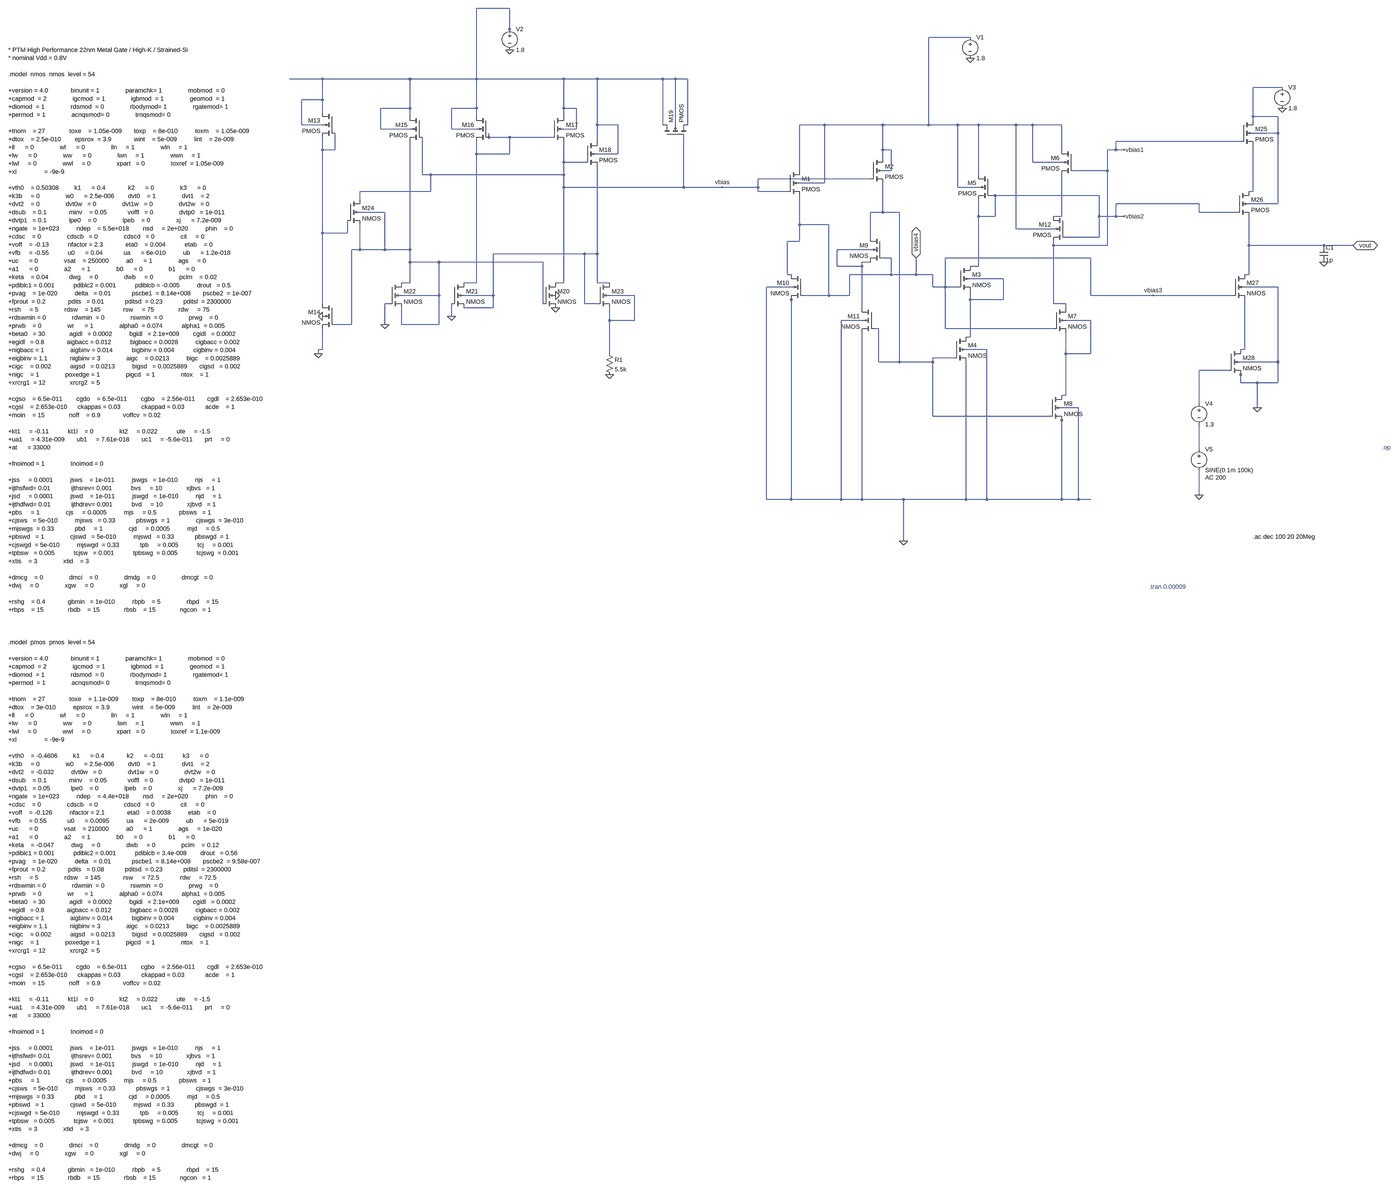
[diagram p0: schematic 22NM_CIRCUIT.asc, whole sheet]
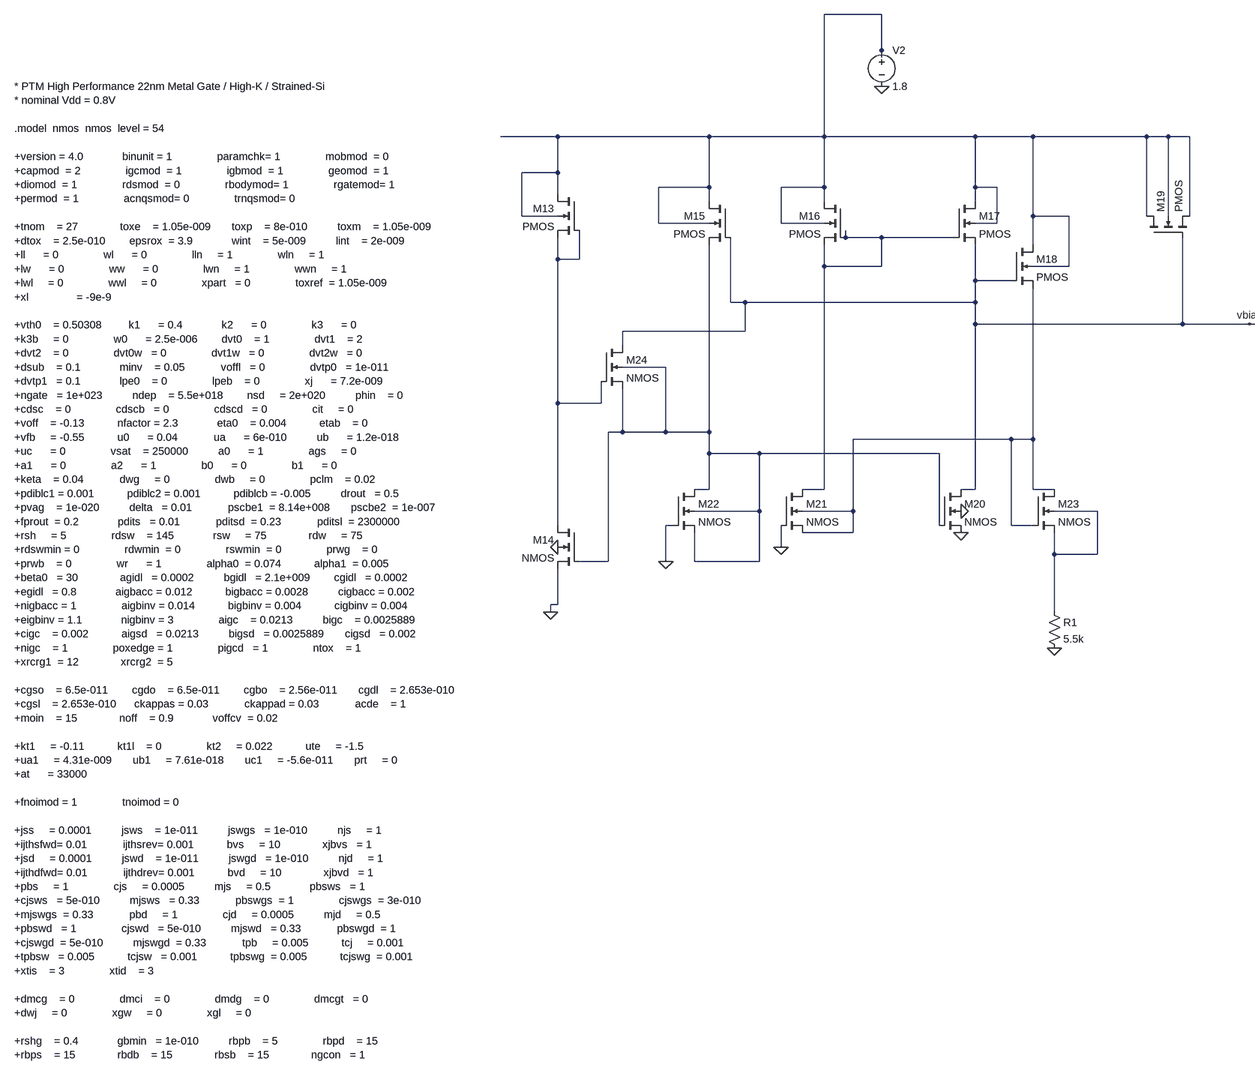
[diagram p1: schematic 22NM_CIRCUIT.asc, part, row 1 of 2, column 1 of 2]
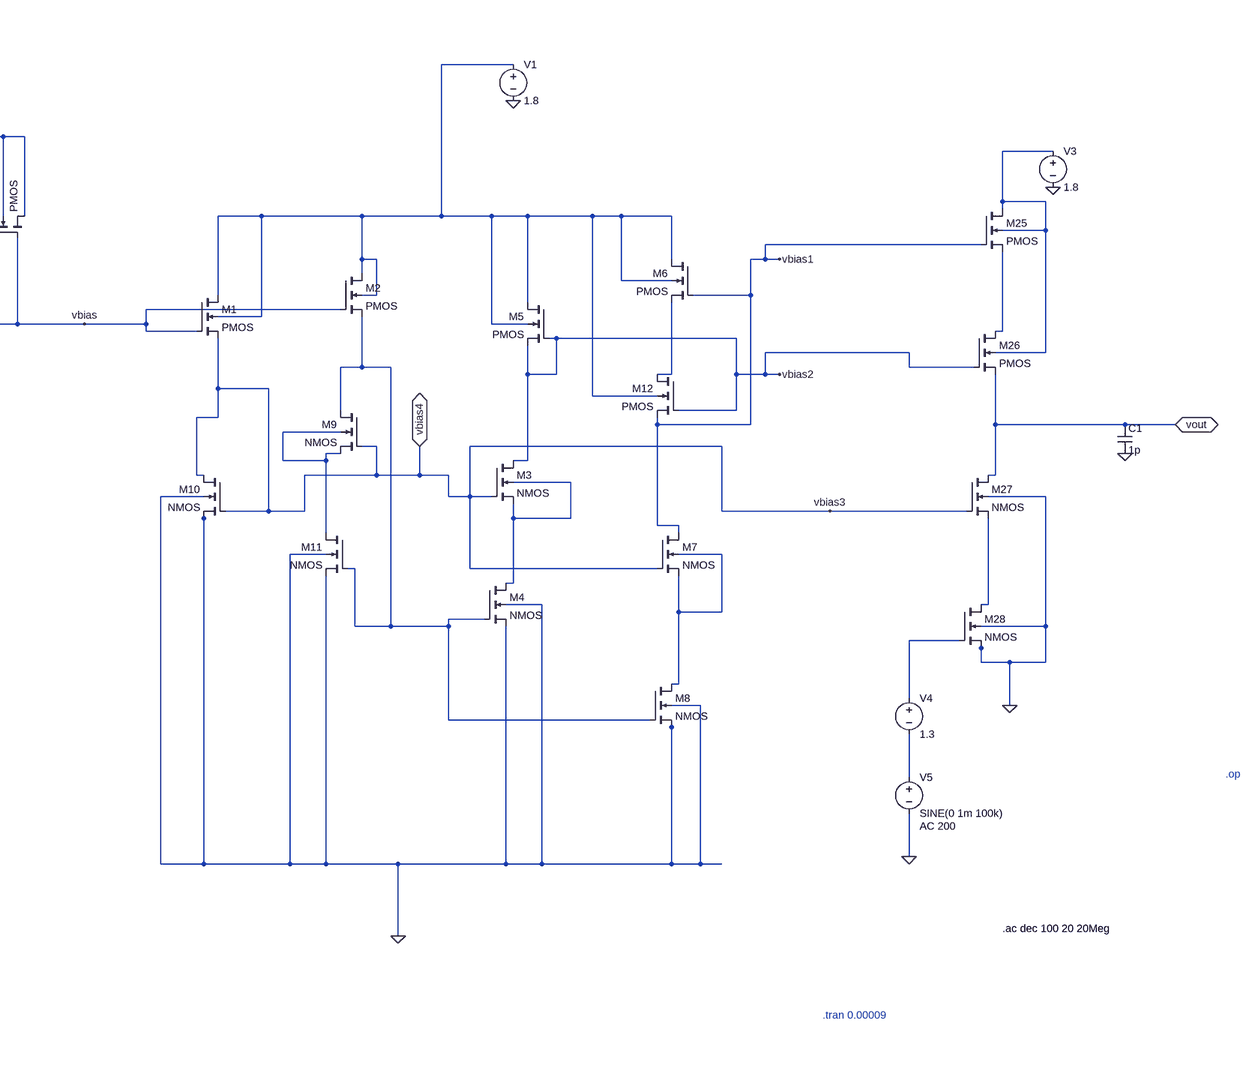
[diagram p2: schematic 22NM_CIRCUIT.asc, part, row 1 of 2, column 2 of 2]
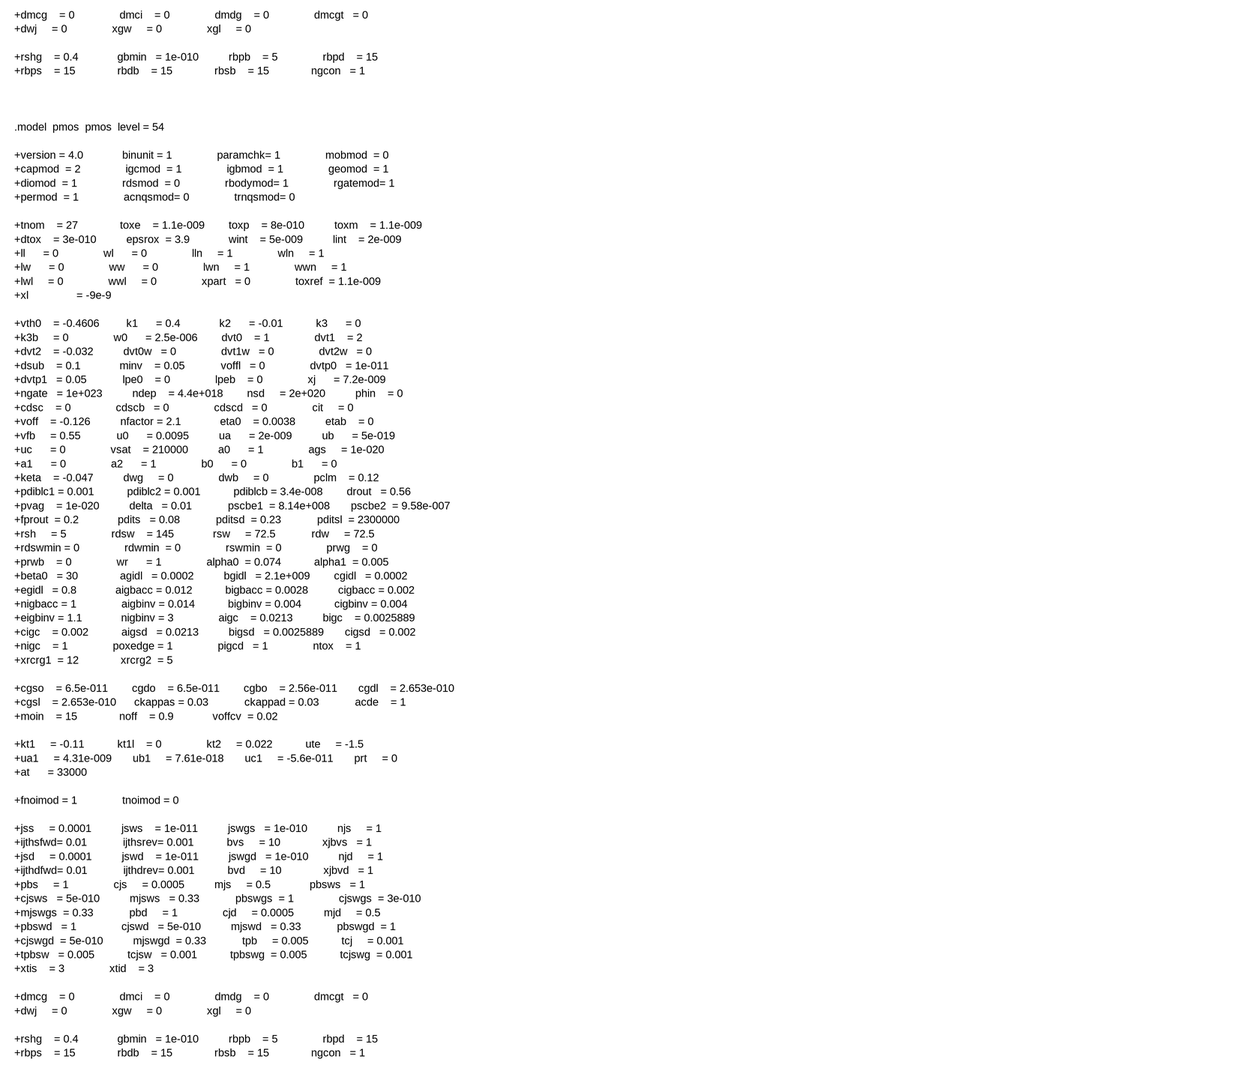
[diagram p3: schematic 22NM_CIRCUIT.asc, part, row 2 of 2, column 1 of 2]
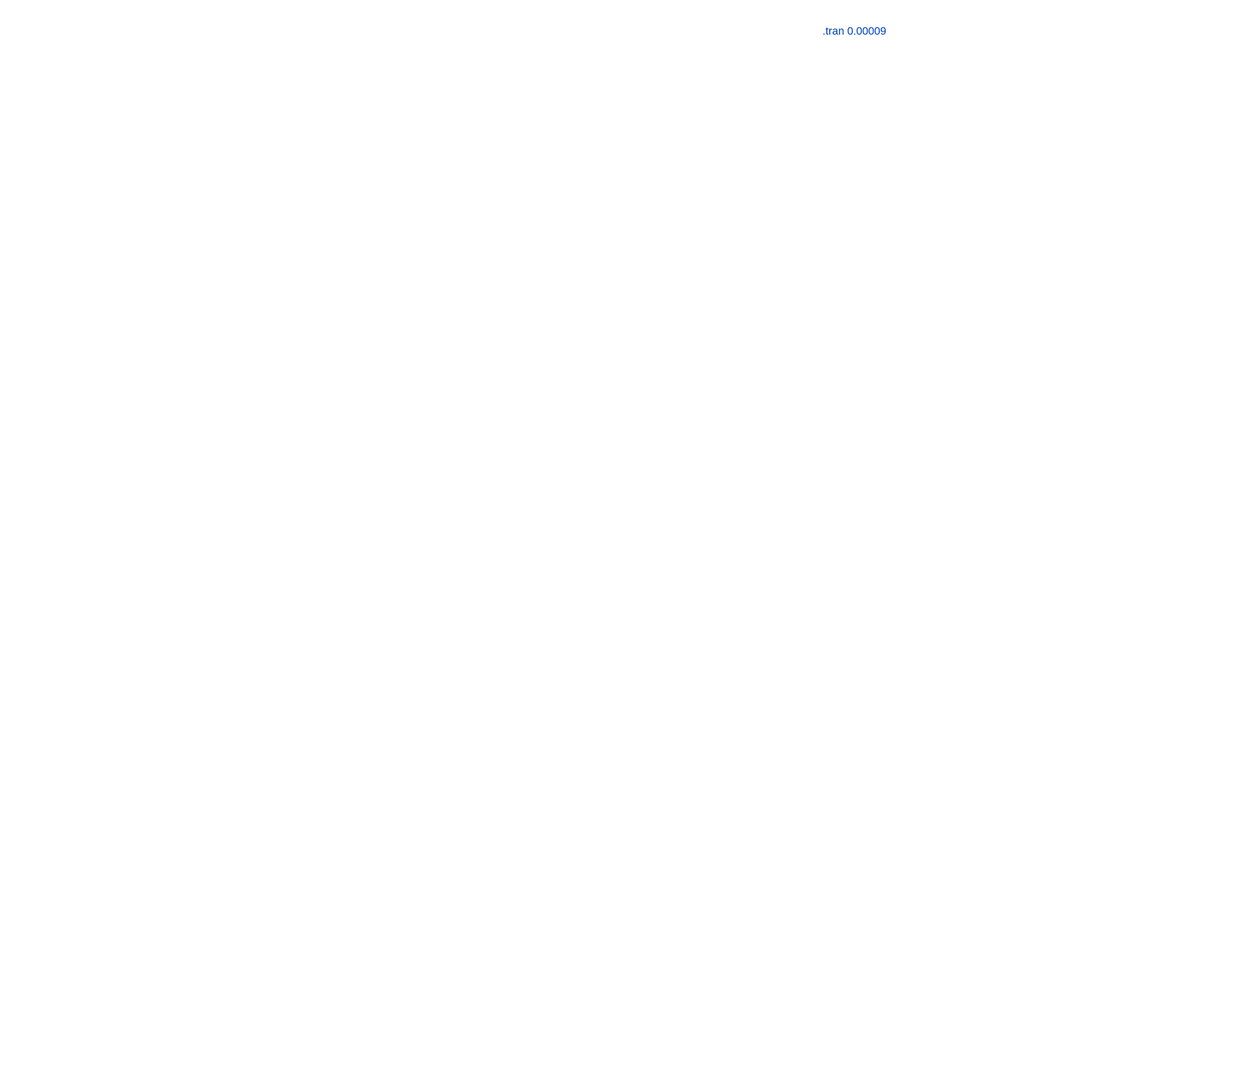
[diagram p4: schematic 22NM_CIRCUIT.asc, part, row 2 of 2, column 2 of 2]
22NM_CIRCUIT.asc, the LTspice schematic file:
Version 4
SHEET 1 4888 3128
WIRE 1008 -912 880 -912
WIRE 1008 -832 1008 -912
WIRE 1008 -816 1008 -832
WIRE 3264 -800 3104 -800
WIRE 288 -640 160 -640
WIRE 624 -640 288 -640
WIRE 880 -640 880 -912
WIRE 880 -640 624 -640
WIRE 1216 -640 880 -640
WIRE 1344 -640 1216 -640
WIRE 1632 -640 1344 -640
WIRE 1680 -640 1632 -640
WIRE 1728 -640 1680 -640
WIRE 4464 -608 4352 -608
WIRE 288 -560 288 -640
WIRE 288 -560 208 -560
WIRE 624 -528 624 -640
WIRE 624 -528 512 -528
WIRE 880 -528 880 -640
WIRE 880 -528 784 -528
WIRE 1216 -528 1216 -640
WIRE 1264 -528 1216 -528
WIRE 288 -512 288 -560
WIRE 624 -496 624 -528
WIRE 880 -496 880 -528
WIRE 1216 -496 1216 -528
WIRE 4352 -496 4352 -608
WIRE 4448 -496 4352 -496
WIRE 4352 -480 4352 -496
WIRE 208 -464 208 -560
WIRE 288 -464 208 -464
WIRE 1344 -464 1344 -640
WIRE 1424 -464 1344 -464
WIRE 1632 -464 1632 -640
WIRE 1680 -464 1680 -640
WIRE 1728 -464 1728 -640
WIRE 2704 -464 2608 -464
WIRE 2928 -464 2704 -464
WIRE 3104 -464 3104 -800
WIRE 3104 -464 2928 -464
WIRE 3216 -464 3104 -464
WIRE 3296 -464 3216 -464
WIRE 3440 -464 3296 -464
WIRE 3504 -464 3440 -464
WIRE 3616 -464 3504 -464
WIRE 512 -448 512 -528
WIRE 624 -448 512 -448
WIRE 784 -448 784 -528
WIRE 880 -448 784 -448
WIRE 1264 -448 1264 -528
WIRE 1264 -448 1216 -448
WIRE 4448 -432 4448 -496
WIRE 4448 -432 4352 -432
WIRE 928 -416 928 -432
WIRE 1008 -416 928 -416
WIRE 1168 -416 1008 -416
WIRE 1344 -400 1344 -464
WIRE 4304 -400 3824 -400
WIRE 288 -368 288 -416
WIRE 336 -368 336 -432
WIRE 336 -368 288 -368
WIRE 2928 -368 2928 -464
WIRE 2960 -368 2928 -368
WIRE 3616 -368 3616 -464
WIRE 3824 -368 3824 -400
WIRE 3824 -368 3792 -368
WIRE 3856 -368 3824 -368
WIRE 880 -352 880 -400
WIRE 1008 -352 1008 -416
WIRE 1008 -352 880 -352
WIRE 1424 -352 1424 -464
WIRE 1424 -352 1344 -352
WIRE 2928 -336 2928 -368
WIRE 1216 -320 1216 -400
WIRE 1296 -320 1216 -320
WIRE 3504 -320 3504 -464
WIRE 3616 -320 3504 -320
WIRE 2608 -288 2608 -464
WIRE 2960 -288 2960 -368
WIRE 2960 -288 2928 -288
WIRE 3792 -288 3792 -368
WIRE 3792 -288 3664 -288
WIRE 672 -272 672 -416
WIRE 704 -272 672 -272
WIRE 1216 -272 1216 -320
WIRE 1216 -272 704 -272
WIRE 3296 -272 3296 -464
WIRE 2880 -256 2448 -256
WIRE 2704 -240 2704 -464
WIRE 2704 -240 2608 -240
WIRE 1216 -224 1216 -272
WIRE 1712 -224 1712 -416
WIRE 1712 -224 1216 -224
WIRE 2064 -224 1712 -224
WIRE 2448 -224 2448 -256
WIRE 2448 -224 2064 -224
WIRE 3216 -224 3216 -464
WIRE 3296 -224 3216 -224
WIRE 704 -208 704 -272
WIRE 704 -208 432 -208
WIRE 2448 -208 2448 -224
WIRE 2560 -208 2448 -208
WIRE 4352 -208 4352 -384
WIRE 4352 -208 4336 -208
WIRE 3360 -192 3344 -192
WIRE 3760 -192 3360 -192
WIRE 432 -176 432 -208
WIRE 4144 -160 3824 -160
WIRE 4448 -160 4448 -432
WIRE 4448 -160 4336 -160
WIRE 528 -128 432 -128
WIRE 2928 -128 2928 -240
WIRE 2928 -128 2880 -128
WIRE 2992 -128 2928 -128
WIRE 4144 -128 4144 -160
WIRE 4288 -128 4144 -128
WIRE 3296 -112 3296 -176
WIRE 3360 -112 3360 -192
WIRE 3360 -112 3296 -112
WIRE 3616 -112 3616 -272
WIRE 3616 -112 3584 -112
WIRE 3760 -112 3760 -192
WIRE 3824 -112 3824 -160
WIRE 3824 -112 3760 -112
WIRE 3856 -112 3824 -112
WIRE 2608 -80 2608 -192
WIRE 2720 -80 2608 -80
WIRE 3440 -64 3440 -464
WIRE 3584 -64 3440 -64
WIRE 288 -48 288 -368
WIRE 384 -48 384 -96
WIRE 384 -48 288 -48
WIRE 2880 -32 2880 -128
WIRE 3760 -32 3760 -112
WIRE 3760 -32 3632 -32
WIRE 2608 -16 2608 -80
WIRE 2608 -16 2560 -16
WIRE 3584 0 3584 -16
WIRE 3792 0 3792 -288
WIRE 3792 0 3584 0
WIRE 4336 0 4336 -112
WIRE 4624 0 4336 0
WIRE 4736 0 4624 0
WIRE 432 16 432 -80
WIRE 432 16 400 16
WIRE 528 16 528 -128
WIRE 528 16 432 16
WIRE 624 16 624 -400
WIRE 624 16 528 16
WIRE 2880 16 2752 16
WIRE 1296 32 944 32
WIRE 1344 32 1344 -304
WIRE 1344 32 1296 32
WIRE 2960 48 2928 48
WIRE 3728 48 3168 48
WIRE 624 64 624 16
WIRE 736 64 624 64
WIRE 1136 64 736 64
WIRE 2880 64 2848 64
WIRE 2752 80 2752 16
WIRE 2848 80 2848 64
WIRE 2848 80 2752 80
WIRE 3296 80 3296 -112
WIRE 3296 80 3264 80
WIRE 2560 112 2560 -16
WIRE 2576 112 2560 112
WIRE 2960 112 2960 48
WIRE 2960 112 2800 112
WIRE 3056 112 3056 48
WIRE 3056 112 2960 112
WIRE 3120 112 3056 112
WIRE 4336 112 4336 0
WIRE 4336 112 4320 112
WIRE 3392 128 3264 128
WIRE 624 144 624 64
WIRE 624 144 592 144
WIRE 880 144 880 -352
WIRE 880 144 832 144
WIRE 1216 144 1216 -224
WIRE 1216 144 1184 144
WIRE 1344 144 1344 32
WIRE 1392 144 1344 144
WIRE 2576 160 2480 160
WIRE 3120 160 3120 112
WIRE 3168 160 3168 48
WIRE 3168 160 3120 160
WIRE 3216 160 3168 160
WIRE 4448 160 4320 160
WIRE 736 192 736 64
WIRE 736 192 592 192
WIRE 944 192 944 32
WIRE 944 192 832 192
WIRE 1488 192 1392 192
WIRE 2720 192 2720 -80
WIRE 2720 192 2624 192
WIRE 2800 192 2800 112
WIRE 2800 192 2720 192
WIRE 3728 192 3728 48
WIRE 3968 192 3728 192
WIRE 4272 192 3968 192
WIRE 2576 208 2576 192
WIRE 3264 208 3264 176
WIRE 3392 208 3392 128
WIRE 3392 208 3264 208
WIRE 288 224 288 -48
WIRE 544 224 528 224
WIRE 1136 224 1136 64
WIRE 1296 224 1296 32
WIRE 1344 224 1296 224
WIRE 3584 224 3584 0
WIRE 3632 224 3584 224
WIRE 944 240 944 192
WIRE 944 240 832 240
WIRE 2848 240 2848 80
WIRE 3632 240 3632 224
WIRE 784 272 784 224
WIRE 1392 288 1392 240
WIRE 1488 288 1488 192
WIRE 1488 288 1392 288
WIRE 2848 288 2768 288
WIRE 3728 288 3632 288
WIRE 400 304 400 16
WIRE 400 304 336 304
WIRE 528 304 528 224
WIRE 592 304 592 240
WIRE 736 304 736 192
WIRE 736 304 592 304
WIRE 2912 320 2896 320
WIRE 3168 320 3168 160
WIRE 3584 320 3168 320
WIRE 3264 352 3264 208
WIRE 3264 352 3248 352
WIRE 288 400 288 320
WIRE 288 400 272 400
WIRE 3328 400 3248 400
WIRE 4320 400 4320 208
WIRE 4320 400 4304 400
WIRE 272 416 272 400
WIRE 1392 416 1392 288
WIRE 3632 416 3632 336
WIRE 3728 416 3728 288
WIRE 3728 416 3632 416
WIRE 3200 432 3120 432
WIRE 2912 448 2912 320
WIRE 2992 448 2992 -128
WIRE 2992 448 2912 448
WIRE 3120 448 3120 432
WIRE 3120 448 2992 448
WIRE 4448 448 4448 160
WIRE 4448 448 4304 448
WIRE 4256 480 4144 480
WIRE 4304 496 4304 480
WIRE 4304 528 4304 496
WIRE 4368 528 4304 528
WIRE 4448 528 4448 448
WIRE 4448 528 4368 528
WIRE 3632 576 3632 416
WIRE 3632 576 3616 576
WIRE 4144 608 4144 480
WIRE 3680 624 3616 624
WIRE 4368 624 4368 528
WIRE 3120 656 3120 448
WIRE 3568 656 3120 656
WIRE 3616 672 3616 656
WIRE 4144 784 4144 688
WIRE 4144 960 4144 864
WIRE 2480 976 2480 160
WIRE 2576 976 2576 208
WIRE 2576 976 2480 976
WIRE 2768 976 2768 288
WIRE 2768 976 2576 976
WIRE 2848 976 2848 336
WIRE 2848 976 2768 976
WIRE 3008 976 2848 976
WIRE 3248 976 3248 448
WIRE 3248 976 3008 976
WIRE 3328 976 3328 400
WIRE 3328 976 3248 976
WIRE 3616 976 3616 672
WIRE 3616 976 3328 976
WIRE 3680 976 3680 624
WIRE 3680 976 3616 976
WIRE 3728 976 3680 976
WIRE 3008 1136 3008 976
FLAG 3856 -112 vbias2
FLAG 3856 -368 vbias1
FLAG 4464 -528 0
FLAG 4368 624 0
FLAG 4144 960 0
FLAG 4624 64 0
FLAG 4736 0 vout
IOPIN 4736 0 BiDir
FLAG 3968 192 vbias3
FLAG 3056 48 vbias4
IOPIN 3056 48 BiDir
FLAG 3264 -720 0
FLAG 3008 1136 0
FLAG 1392 496 0
FLAG 1184 240 0
FLAG 784 272 0
FLAG 528 304 0
FLAG 272 416 0
FLAG 1184 192 0
FLAG 288 272 0
FLAG 2064 -224 vbias
FLAG 1008 -752 0
DATAFLAG 3296 -64 ""
DATAFLAG 3296 -320 ""
SYMBOL nmos4 4304 -480 R0
SYMATTR InstName M25
SYMATTR Value PMOS
SYMATTR Value2 l=0.022u w=0.497u
SYMBOL nmos4 4288 -208 R0
SYMATTR InstName M26
SYMATTR Value PMOS
SYMATTR Value2 l=0.022u w=0.497u
SYMBOL nmos4 4272 112 R0
SYMATTR InstName M27
SYMATTR Value2 l=0.022u w=0.248u
SYMBOL nmos4 4256 400 R0
SYMATTR InstName M28
SYMATTR Value2 l=0.022u w=0.248u
SYMBOL voltage 4464 -624 R0
WINDOW 123 0 0 Left 0
WINDOW 39 0 0 Left 0
SYMATTR InstName V3
SYMATTR Value 1.8
SYMBOL cap 4608 0 R0
SYMATTR InstName C1
SYMATTR Value 1p
SYMBOL voltage 4144 592 R0
WINDOW 123 0 0 Left 0
WINDOW 39 0 0 Left 0
SYMATTR InstName V4
SYMATTR Value 1.3
SYMBOL voltage 4144 768 R0
WINDOW 123 24 124 Left 2
WINDOW 39 0 0 Left 0
SYMATTR Value2 AC 200
SYMATTR InstName V5
SYMATTR Value SINE(0 1m 100k)
SYMBOL nmos4 2560 -288 R0
SYMATTR InstName M1
SYMATTR Value PMOS
SYMATTR Value2 l=2u w=24u
SYMBOL nmos4 2880 -336 R0
SYMATTR InstName M2
SYMATTR Value PMOS
SYMATTR Value2 l=2u w=24u
SYMBOL nmos4 3216 80 R0
SYMATTR InstName M3
SYMATTR Value2 l=2u w=10u
SYMBOL nmos4 3200 352 R0
SYMATTR InstName M4
SYMATTR Value2 l=2u w=10u
SYMBOL nmos4 3344 -272 M0
SYMATTR InstName M5
SYMATTR Value PMOS
SYMATTR Value2 l=2u w=24u
SYMBOL nmos4 3664 -368 M0
SYMATTR InstName M6
SYMATTR Value PMOS
SYMATTR Value2 l=2u w=24u
SYMBOL nmos4 3584 240 R0
SYMATTR InstName M7
SYMATTR Value2 l=2u w=10u
SYMBOL nmos4 3568 576 R0
SYMATTR InstName M8
SYMATTR Value2 l=2u w=10u
SYMBOL nmos4 2928 -32 M0
SYMATTR InstName M9
SYMATTR Value2 l=2u w=10u
SYMBOL nmos4 2624 112 M0
SYMATTR InstName M10
SYMATTR Value2 l=2u w=10u
SYMBOL nmos4 2896 240 M0
SYMATTR InstName M11
SYMATTR Value2 l=2u w=10u
SYMBOL nmos4 3632 -112 M0
SYMATTR InstName M12
SYMATTR Value PMOS
SYMATTR Value2 l=2u w=24u
SYMBOL voltage 3264 -816 R0
WINDOW 123 0 0 Left 0
WINDOW 39 0 0 Left 0
SYMATTR InstName V1
SYMATTR Value 1.8
SYMBOL nmos4 336 -512 M0
SYMATTR InstName M13
SYMATTR Value PMOS
SYMATTR Value2 l=2u w=24u
SYMBOL nmos4 336 224 M0
SYMATTR InstName M14
SYMATTR Value2 l=2u w=10u
SYMBOL nmos4 672 -496 M0
SYMATTR InstName M15
SYMATTR Value PMOS
SYMATTR Value2 l=2u w=24u
SYMBOL nmos4 928 -496 M0
SYMATTR InstName M16
SYMATTR Value PMOS
SYMATTR Value2 l=2u w=24u
SYMBOL nmos4 1168 -496 R0
SYMATTR InstName M17
SYMATTR Value PMOS
SYMATTR Value2 l=2u w=24u
SYMBOL nmos4 1296 -400 R0
SYMATTR InstName M18
SYMATTR Value PMOS
SYMATTR Value2 l=2u w=24u
SYMBOL nmos4 1632 -416 R270
SYMATTR InstName M19
SYMATTR Value PMOS
SYMATTR Value2 l=2u w=24u
SYMBOL nmos4 1136 144 R0
SYMATTR InstName M20
SYMATTR Value2 l=2u w=10u
SYMBOL nmos4 784 144 R0
SYMATTR InstName M21
SYMATTR Value2 l=2u w=10u
SYMBOL nmos4 544 144 R0
SYMATTR InstName M22
SYMATTR Value2 l=2u w=10u
SYMBOL nmos4 1344 144 R0
SYMATTR InstName M23
SYMATTR Value2 l=2u w=10u
SYMBOL nmos4 384 -176 R0
SYMATTR InstName M24
SYMATTR Value2 l=2u w=10u
SYMBOL res 1376 400 R0
SYMATTR InstName R1
SYMATTR Value 5.5k
SYMBOL voltage 1008 -848 R0
WINDOW 123 0 0 Left 0
WINDOW 39 0 0 Left 0
SYMATTR InstName V2
SYMATTR Value 1.8
TEXT 4352 1120 Left 2 !.ac dec 100 20 20Meg
TEXT -4064 -752 Left 2 !* PTM High Performance 22nm Metal Gate / High-K / Strained-Si\n* nominal Vdd = 0.8V\n \n.model  nmos  nmos  level = 54\n \n+version = 4.0             binunit = 1               paramchk= 1               mobmod  = 0             \n+capmod  = 2               igcmod  = 1               igbmod  = 1               geomod  = 1             \n+diomod  = 1               rdsmod  = 0               rbodymod= 1               rgatemod= 1             \n+permod  = 1               acnqsmod= 0               trnqsmod= 0             \n \n+tnom    = 27              toxe    = 1.05e-009       toxp    = 8e-010          toxm    = 1.05e-009     \n+dtox    = 2.5e-010        epsrox  = 3.9             wint    = 5e-009          lint    = 2e-009        \n+ll      = 0               wl      = 0               lln     = 1               wln     = 1             \n+lw      = 0               ww      = 0               lwn     = 1               wwn     = 1             \n+lwl     = 0               wwl     = 0               xpart   = 0               toxref  = 1.05e-009     \n+xl                = -9e-9\n \n+vth0    = 0.50308         k1      = 0.4             k2      = 0               k3      = 0             \n+k3b     = 0               w0      = 2.5e-006        dvt0    = 1               dvt1    = 2             \n+dvt2    = 0               dvt0w   = 0               dvt1w   = 0               dvt2w   = 0             \n+dsub    = 0.1             minv    = 0.05            voffl   = 0               dvtp0   = 1e-011        \n+dvtp1   = 0.1             lpe0    = 0               lpeb    = 0               xj      = 7.2e-009      \n+ngate   = 1e+023          ndep    = 5.5e+018        nsd     = 2e+020          phin    = 0             \n+cdsc    = 0               cdscb   = 0               cdscd   = 0               cit     = 0             \n+voff    = -0.13           nfactor = 2.3             eta0    = 0.004           etab    = 0             \n+vfb     = -0.55           u0      = 0.04            ua      = 6e-010          ub      = 1.2e-018      \n+uc      = 0               vsat    = 250000          a0      = 1               ags     = 0             \n+a1      = 0               a2      = 1               b0      = 0               b1      = 0             \n+keta    = 0.04            dwg     = 0               dwb     = 0               pclm    = 0.02          \n+pdiblc1 = 0.001           pdiblc2 = 0.001           pdiblcb = -0.005          drout   = 0.5           \n+pvag    = 1e-020          delta   = 0.01            pscbe1  = 8.14e+008       pscbe2  = 1e-007        \n+fprout  = 0.2             pdits   = 0.01            pditsd  = 0.23            pditsl  = 2300000       \n+rsh     = 5               rdsw    = 145             rsw     = 75              rdw     = 75            \n+rdswmin = 0               rdwmin  = 0               rswmin  = 0               prwg    = 0             \n+prwb    = 0               wr      = 1               alpha0  = 0.074           alpha1  = 0.005         \n+beta0   = 30              agidl   = 0.0002          bgidl   = 2.1e+009        cgidl   = 0.0002        \n+egidl   = 0.8             aigbacc = 0.012           bigbacc = 0.0028          cigbacc = 0.002         \n+nigbacc = 1               aigbinv = 0.014           bigbinv = 0.004           cigbinv = 0.004         \n+eigbinv = 1.1             nigbinv = 3               aigc    = 0.0213          bigc    = 0.0025889     \n+cigc    = 0.002           aigsd   = 0.0213          bigsd   = 0.0025889       cigsd   = 0.002         \n+nigc    = 1               poxedge = 1               pigcd   = 1               ntox    = 1             \n+xrcrg1  = 12              xrcrg2  = 5             \n \n+cgso    = 6.5e-011        cgdo    = 6.5e-011        cgbo    = 2.56e-011       cgdl    = 2.653e-010    \n+cgsl    = 2.653e-010      ckappas = 0.03            ckappad = 0.03            acde    = 1             \n+moin    = 15              noff    = 0.9             voffcv  = 0.02          \n \n+kt1     = -0.11           kt1l    = 0               kt2     = 0.022           ute     = -1.5          \n+ua1     = 4.31e-009       ub1     = 7.61e-018       uc1     = -5.6e-011       prt     = 0             \n+at      = 33000         \n \n+fnoimod = 1               tnoimod = 0             \n \n+jss     = 0.0001          jsws    = 1e-011          jswgs   = 1e-010          njs     = 1             \n+ijthsfwd= 0.01            ijthsrev= 0.001           bvs     = 10              xjbvs   = 1             \n+jsd     = 0.0001          jswd    = 1e-011          jswgd   = 1e-010          njd     = 1             \n+ijthdfwd= 0.01            ijthdrev= 0.001           bvd     = 10              xjbvd   = 1             \n+pbs     = 1               cjs     = 0.0005          mjs     = 0.5             pbsws   = 1             \n+cjsws   = 5e-010          mjsws   = 0.33            pbswgs  = 1               cjswgs  = 3e-010        \n+mjswgs  = 0.33            pbd     = 1               cjd     = 0.0005          mjd     = 0.5           \n+pbswd   = 1               cjswd   = 5e-010          mjswd   = 0.33            pbswgd  = 1             \n+cjswgd  = 5e-010          mjswgd  = 0.33            tpb     = 0.005           tcj     = 0.001         \n+tpbsw   = 0.005           tcjsw   = 0.001           tpbswg  = 0.005           tcjswg  = 0.001         \n+xtis    = 3               xtid    = 3             \n \n+dmcg    = 0               dmci    = 0               dmdg    = 0               dmcgt   = 0             \n+dwj     = 0               xgw     = 0               xgl     = 0             \n \n+rshg    = 0.4             gbmin   = 1e-010          rbpb    = 5               rbpd    = 15            \n+rbps    = 15              rbdb    = 15              rbsb    = 15              ngcon   = 1             \n \n\n \n.model  pmos  pmos  level = 54\n \n+version = 4.0             binunit = 1               paramchk= 1               mobmod  = 0             \n+capmod  = 2               igcmod  = 1               igbmod  = 1               geomod  = 1             \n+diomod  = 1               rdsmod  = 0               rbodymod= 1               rgatemod= 1             \n+permod  = 1               acnqsmod= 0               trnqsmod= 0             \n \n+tnom    = 27              toxe    = 1.1e-009        toxp    = 8e-010          toxm    = 1.1e-009      \n+dtox    = 3e-010          epsrox  = 3.9             wint    = 5e-009          lint    = 2e-009        \n+ll      = 0               wl      = 0               lln     = 1               wln     = 1             \n+lw      = 0               ww      = 0               lwn     = 1               wwn     = 1             \n+lwl     = 0               wwl     = 0               xpart   = 0               toxref  = 1.1e-009      \n+xl                = -9e-9\n \n+vth0    = -0.4606         k1      = 0.4             k2      = -0.01           k3      = 0             \n+k3b     = 0               w0      = 2.5e-006        dvt0    = 1               dvt1    = 2             \n+dvt2    = -0.032          dvt0w   = 0               dvt1w   = 0               dvt2w   = 0             \n+dsub    = 0.1             minv    = 0.05            voffl   = 0               dvtp0   = 1e-011        \n+dvtp1   = 0.05            lpe0    = 0               lpeb    = 0               xj      = 7.2e-009      \n+ngate   = 1e+023          ndep    = 4.4e+018        nsd     = 2e+020          phin    = 0             \n+cdsc    = 0               cdscb   = 0               cdscd   = 0               cit     = 0             \n+voff    = -0.126          nfactor = 2.1             eta0    = 0.0038          etab    = 0             \n+vfb     = 0.55            u0      = 0.0095          ua      = 2e-009          ub      = 5e-019        \n+uc      = 0               vsat    = 210000          a0      = 1               ags     = 1e-020        \n+a1      = 0               a2      = 1               b0      = 0               b1      = 0             \n+keta    = -0.047          dwg     = 0               dwb     = 0               pclm    = 0.12          \n+pdiblc1 = 0.001           pdiblc2 = 0.001           pdiblcb = 3.4e-008        drout   = 0.56          \n+pvag    = 1e-020          delta   = 0.01            pscbe1  = 8.14e+008       pscbe2  = 9.58e-007     \n+fprout  = 0.2             pdits   = 0.08            pditsd  = 0.23            pditsl  = 2300000       \n+rsh     = 5               rdsw    = 145             rsw     = 72.5            rdw     = 72.5          \n+rdswmin = 0               rdwmin  = 0               rswmin  = 0               prwg    = 0             \n+prwb    = 0               wr      = 1               alpha0  = 0.074           alpha1  = 0.005         \n+beta0   = 30              agidl   = 0.0002          bgidl   = 2.1e+009        cgidl   = 0.0002        \n+egidl   = 0.8             aigbacc = 0.012           bigbacc = 0.0028          cigbacc = 0.002         \n+nigbacc = 1               aigbinv = 0.014           bigbinv = 0.004           cigbinv = 0.004         \n+eigbinv = 1.1             nigbinv = 3               aigc    = 0.0213          bigc    = 0.0025889     \n+cigc    = 0.002           aigsd   = 0.0213          bigsd   = 0.0025889       cigsd   = 0.002         \n+nigc    = 1               poxedge = 1               pigcd   = 1               ntox    = 1             \n+xrcrg1  = 12              xrcrg2  = 5             \n \n+cgso    = 6.5e-011        cgdo    = 6.5e-011        cgbo    = 2.56e-011       cgdl    = 2.653e-010    \n+cgsl    = 2.653e-010      ckappas = 0.03            ckappad = 0.03            acde    = 1             \n+moin    = 15              noff    = 0.9             voffcv  = 0.02          \n \n+kt1     = -0.11           kt1l    = 0               kt2     = 0.022           ute     = -1.5          \n+ua1     = 4.31e-009       ub1     = 7.61e-018       uc1     = -5.6e-011       prt     = 0             \n+at      = 33000         \n \n+fnoimod = 1               tnoimod = 0             \n \n+jss     = 0.0001          jsws    = 1e-011          jswgs   = 1e-010          njs     = 1             \n+ijthsfwd= 0.01            ijthsrev= 0.001           bvs     = 10              xjbvs   = 1             \n+jsd     = 0.0001          jswd    = 1e-011          jswgd   = 1e-010          njd     = 1             \n+ijthdfwd= 0.01            ijthdrev= 0.001           bvd     = 10              xjbvd   = 1             \n+pbs     = 1               cjs     = 0.0005          mjs     = 0.5             pbsws   = 1             \n+cjsws   = 5e-010          mjsws   = 0.33            pbswgs  = 1               cjswgs  = 3e-010        \n+mjswgs  = 0.33            pbd     = 1               cjd     = 0.0005          mjd     = 0.5           \n+pbswd   = 1               cjswd   = 5e-010          mjswd   = 0.33            pbswgd  = 1             \n+cjswgd  = 5e-010          mjswgd  = 0.33            tpb     = 0.005           tcj     = 0.001         \n+tpbsw   = 0.005           tcjsw   = 0.001           tpbswg  = 0.005           tcjswg  = 0.001         \n+xtis    = 3               xtid    = 3             \n \n+dmcg    = 0               dmci    = 0               dmdg    = 0               dmcgt   = 0             \n+dwj     = 0               xgw     = 0               xgl     = 0             \n \n+rshg    = 0.4             gbmin   = 1e-010          rbpb    = 5               rbpd    = 15            \n+rbps    = 15              rbdb    = 15              rbsb    = 15              ngcon   = 1
TEXT 3952 1312 Left 2 ;.tran 0.00009
TEXT 4848 776 Left 2 ;.op

The netlist it stands for:
* 22NM_CIRCUIT.asc
M25 N003 vbias1 N006 N003 PMOS l=0.022u w=0.497u
M26 N006 vbias2 vout N003 PMOS l=0.022u w=0.497u
M27 vout vbias4 N015 0 NMOS l=0.022u w=0.248u
M28 N015 N016 0 0 NMOS l=0.022u w=0.248u
V3 N003 0 1.8
C1 vout 0 1p
V4 N016 N017 1.3
V5 N017 0 SINE(0 1m 100k) AC 200
M1 N002 vbias vbias4 N002 PMOS l=2u w=24u
M2 N002 vbias N008 N002 PMOS l=2u w=24u
M3 vbias2 vbias4 N012 N012 NMOS l=2u w=10u
M4 N012 N008 0 0 NMOS l=2u w=10u
M5 N002 vbias2 vbias2 N002 PMOS l=2u w=24u
M6 N002 vbias1 N009 N002 PMOS l=2u w=24u
M7 vbias1 vbias4 N014 N014 NMOS l=2u w=10u
M8 N014 N008 0 0 NMOS l=2u w=10u
M9 N008 vbias4 N010 N010 NMOS l=2u w=10u
M10 vbias4 vbias4 0 0 NMOS l=2u w=10u
M11 N010 N008 0 0 NMOS l=2u w=10u
M12 N009 vbias2 vbias1 N002 PMOS l=2u w=24u
V1 N002 0 1.8
M13 N001 N005 N005 N001 PMOS l=2u w=24u
M14 N005 N007 0 0 NMOS l=2u w=10u
M15 N001 vbias N007 N001 PMOS l=2u w=24u
M16 N001 N004 N004 N001 PMOS l=2u w=24u
M17 N001 N004 vbias N001 PMOS l=2u w=24u
M18 N001 vbias N011 N001 PMOS l=2u w=24u
M19 N001 vbias N001 N001 PMOS l=2u w=24u
M20 vbias N007 0 0 NMOS l=2u w=10u
M21 N004 0 N011 N011 NMOS l=2u w=10u
M22 N007 0 N007 N007 NMOS l=2u w=10u
M23 N011 N011 N013 N013 NMOS l=2u w=10u
M24 vbias N005 N007 N007 NMOS l=2u w=10u
R1 N013 0 5.5k
V2 N001 0 1.8
.model NMOS NMOS
.model PMOS PMOS
.lib standard.mos
.ac dec 100 20 20Meg
* PTM High Performance 22nm Metal Gate / High-K / Strained-Si
* nominal Vdd = 0.8V
.model  nmos  nmos  level = 54
+version = 4.0             binunit = 1               paramchk= 1               mobmod  = 0
+capmod  = 2               igcmod  = 1               igbmod  = 1               geomod  = 1
+diomod  = 1               rdsmod  = 0               rbodymod= 1               rgatemod= 1
+permod  = 1               acnqsmod= 0               trnqsmod= 0
+tnom    = 27              toxe    = 1.05e-009       toxp    = 8e-010          toxm    = 1.05e-009
+dtox    = 2.5e-010        epsrox  = 3.9             wint    = 5e-009          lint    = 2e-009
+ll      = 0               wl      = 0               lln     = 1               wln     = 1
+lw      = 0               ww      = 0               lwn     = 1               wwn     = 1
+lwl     = 0               wwl     = 0               xpart   = 0               toxref  = 1.05e-009
+xl                = -9e-9
+vth0    = 0.50308         k1      = 0.4             k2      = 0               k3      = 0
+k3b     = 0               w0      = 2.5e-006        dvt0    = 1               dvt1    = 2
+dvt2    = 0               dvt0w   = 0               dvt1w   = 0               dvt2w   = 0
+dsub    = 0.1             minv    = 0.05            voffl   = 0               dvtp0   = 1e-011
+dvtp1   = 0.1             lpe0    = 0               lpeb    = 0               xj      = 7.2e-009
+ngate   = 1e+023          ndep    = 5.5e+018        nsd     = 2e+020          phin    = 0
+cdsc    = 0               cdscb   = 0               cdscd   = 0               cit     = 0
+voff    = -0.13           nfactor = 2.3             eta0    = 0.004           etab    = 0
+vfb     = -0.55           u0      = 0.04            ua      = 6e-010          ub      = 1.2e-018
+uc      = 0               vsat    = 250000          a0      = 1               ags     = 0
+a1      = 0               a2      = 1               b0      = 0               b1      = 0
+keta    = 0.04            dwg     = 0               dwb     = 0               pclm    = 0.02
+pdiblc1 = 0.001           pdiblc2 = 0.001           pdiblcb = -0.005          drout   = 0.5
+pvag    = 1e-020          delta   = 0.01            pscbe1  = 8.14e+008       pscbe2  = 1e-007
+fprout  = 0.2             pdits   = 0.01            pditsd  = 0.23            pditsl  = 2300000
+rsh     = 5               rdsw    = 145             rsw     = 75              rdw     = 75
+rdswmin = 0               rdwmin  = 0               rswmin  = 0               prwg    = 0
+prwb    = 0               wr      = 1               alpha0  = 0.074           alpha1  = 0.005
+beta0   = 30              agidl   = 0.0002          bgidl   = 2.1e+009        cgidl   = 0.0002
+egidl   = 0.8             aigbacc = 0.012           bigbacc = 0.0028          cigbacc = 0.002
+nigbacc = 1               aigbinv = 0.014           bigbinv = 0.004           cigbinv = 0.004
+eigbinv = 1.1             nigbinv = 3               aigc    = 0.0213          bigc    = 0.0025889
+cigc    = 0.002           aigsd   = 0.0213          bigsd   = 0.0025889       cigsd   = 0.002
+nigc    = 1               poxedge = 1               pigcd   = 1               ntox    = 1
+xrcrg1  = 12              xrcrg2  = 5
+cgso    = 6.5e-011        cgdo    = 6.5e-011        cgbo    = 2.56e-011       cgdl    = 2.653e-010
+cgsl    = 2.653e-010      ckappas = 0.03            ckappad = 0.03            acde    = 1
+moin    = 15              noff    = 0.9             voffcv  = 0.02
+kt1     = -0.11           kt1l    = 0               kt2     = 0.022           ute     = -1.5
+ua1     = 4.31e-009       ub1     = 7.61e-018       uc1     = -5.6e-011       prt     = 0
+at      = 33000
+fnoimod = 1               tnoimod = 0
+jss     = 0.0001          jsws    = 1e-011          jswgs   = 1e-010          njs     = 1
+ijthsfwd= 0.01            ijthsrev= 0.001           bvs     = 10              xjbvs   = 1
+jsd     = 0.0001          jswd    = 1e-011          jswgd   = 1e-010          njd     = 1
+ijthdfwd= 0.01            ijthdrev= 0.001           bvd     = 10              xjbvd   = 1
+pbs     = 1               cjs     = 0.0005          mjs     = 0.5             pbsws   = 1
+cjsws   = 5e-010          mjsws   = 0.33            pbswgs  = 1               cjswgs  = 3e-010
+mjswgs  = 0.33            pbd     = 1               cjd     = 0.0005          mjd     = 0.5
+pbswd   = 1               cjswd   = 5e-010          mjswd   = 0.33            pbswgd  = 1
+cjswgd  = 5e-010          mjswgd  = 0.33            tpb     = 0.005           tcj     = 0.001
+tpbsw   = 0.005           tcjsw   = 0.001           tpbswg  = 0.005           tcjswg  = 0.001
+xtis    = 3               xtid    = 3
+dmcg    = 0               dmci    = 0               dmdg    = 0               dmcgt   = 0
+dwj     = 0               xgw     = 0               xgl     = 0
+rshg    = 0.4             gbmin   = 1e-010          rbpb    = 5               rbpd    = 15
+rbps    = 15              rbdb    = 15              rbsb    = 15              ngcon   = 1
.model  pmos  pmos  level = 54
+version = 4.0             binunit = 1               paramchk= 1               mobmod  = 0
+capmod  = 2               igcmod  = 1               igbmod  = 1               geomod  = 1
+diomod  = 1               rdsmod  = 0               rbodymod= 1               rgatemod= 1
+permod  = 1               acnqsmod= 0               trnqsmod= 0
+tnom    = 27              toxe    = 1.1e-009        toxp    = 8e-010          toxm    = 1.1e-009
+dtox    = 3e-010          epsrox  = 3.9             wint    = 5e-009          lint    = 2e-009
+ll      = 0               wl      = 0               lln     = 1               wln     = 1
+lw      = 0               ww      = 0               lwn     = 1               wwn     = 1
+lwl     = 0               wwl     = 0               xpart   = 0               toxref  = 1.1e-009
+xl                = -9e-9
+vth0    = -0.4606         k1      = 0.4             k2      = -0.01           k3      = 0
+k3b     = 0               w0      = 2.5e-006        dvt0    = 1               dvt1    = 2
+dvt2    = -0.032          dvt0w   = 0               dvt1w   = 0               dvt2w   = 0
+dsub    = 0.1             minv    = 0.05            voffl   = 0               dvtp0   = 1e-011
+dvtp1   = 0.05            lpe0    = 0               lpeb    = 0               xj      = 7.2e-009
+ngate   = 1e+023          ndep    = 4.4e+018        nsd     = 2e+020          phin    = 0
+cdsc    = 0               cdscb   = 0               cdscd   = 0               cit     = 0
+voff    = -0.126          nfactor = 2.1             eta0    = 0.0038          etab    = 0
+vfb     = 0.55            u0      = 0.0095          ua      = 2e-009          ub      = 5e-019
+uc      = 0               vsat    = 210000          a0      = 1               ags     = 1e-020
+a1      = 0               a2      = 1               b0      = 0               b1      = 0
+keta    = -0.047          dwg     = 0               dwb     = 0               pclm    = 0.12
+pdiblc1 = 0.001           pdiblc2 = 0.001           pdiblcb = 3.4e-008        drout   = 0.56
+pvag    = 1e-020          delta   = 0.01            pscbe1  = 8.14e+008       pscbe2  = 9.58e-007
+fprout  = 0.2             pdits   = 0.08            pditsd  = 0.23            pditsl  = 2300000
+rsh     = 5               rdsw    = 145             rsw     = 72.5            rdw     = 72.5
+rdswmin = 0               rdwmin  = 0               rswmin  = 0               prwg    = 0
+prwb    = 0               wr      = 1               alpha0  = 0.074           alpha1  = 0.005
+beta0   = 30              agidl   = 0.0002          bgidl   = 2.1e+009        cgidl   = 0.0002
+egidl   = 0.8             aigbacc = 0.012           bigbacc = 0.0028          cigbacc = 0.002
+nigbacc = 1               aigbinv = 0.014           bigbinv = 0.004           cigbinv = 0.004
+eigbinv = 1.1             nigbinv = 3               aigc    = 0.0213          bigc    = 0.0025889
+cigc    = 0.002           aigsd   = 0.0213          bigsd   = 0.0025889       cigsd   = 0.002
+nigc    = 1               poxedge = 1               pigcd   = 1               ntox    = 1
+xrcrg1  = 12              xrcrg2  = 5
+cgso    = 6.5e-011        cgdo    = 6.5e-011        cgbo    = 2.56e-011       cgdl    = 2.653e-010
+cgsl    = 2.653e-010      ckappas = 0.03            ckappad = 0.03            acde    = 1
+moin    = 15              noff    = 0.9             voffcv  = 0.02
+kt1     = -0.11           kt1l    = 0               kt2     = 0.022           ute     = -1.5
+ua1     = 4.31e-009       ub1     = 7.61e-018       uc1     = -5.6e-011       prt     = 0
+at      = 33000
+fnoimod = 1               tnoimod = 0
+jss     = 0.0001          jsws    = 1e-011          jswgs   = 1e-010          njs     = 1
+ijthsfwd= 0.01            ijthsrev= 0.001           bvs     = 10              xjbvs   = 1
+jsd     = 0.0001          jswd    = 1e-011          jswgd   = 1e-010          njd     = 1
+ijthdfwd= 0.01            ijthdrev= 0.001           bvd     = 10              xjbvd   = 1
+pbs     = 1               cjs     = 0.0005          mjs     = 0.5             pbsws   = 1
+cjsws   = 5e-010          mjsws   = 0.33            pbswgs  = 1               cjswgs  = 3e-010
+mjswgs  = 0.33            pbd     = 1               cjd     = 0.0005          mjd     = 0.5
+pbswd   = 1               cjswd   = 5e-010          mjswd   = 0.33            pbswgd  = 1
+cjswgd  = 5e-010          mjswgd  = 0.33            tpb     = 0.005           tcj     = 0.001
+tpbsw   = 0.005           tcjsw   = 0.001           tpbswg  = 0.005           tcjswg  = 0.001
+xtis    = 3               xtid    = 3
+dmcg    = 0               dmci    = 0               dmdg    = 0               dmcgt   = 0
+dwj     = 0               xgw     = 0               xgl     = 0
+rshg    = 0.4             gbmin   = 1e-010          rbpb    = 5               rbpd    = 15
+rbps    = 15              rbdb    = 15              rbsb    = 15              ngcon   = 1
* .tran 0.00009
* .op
.backanno
.end